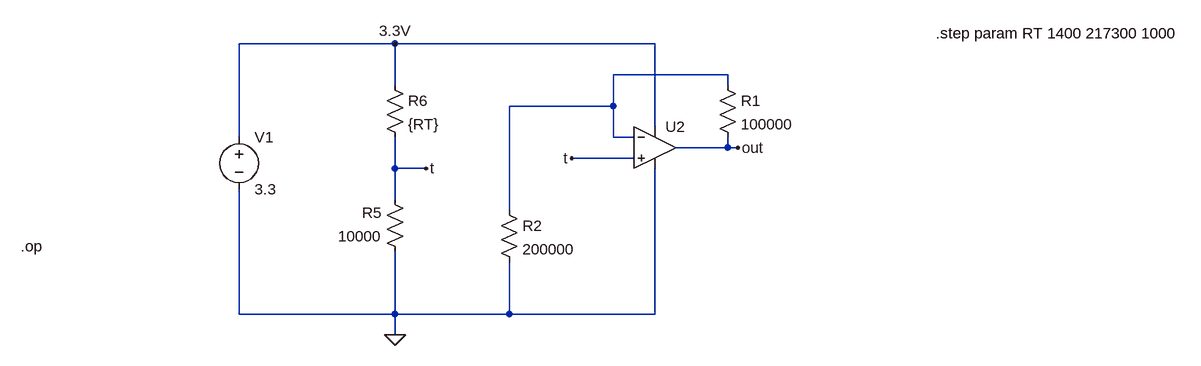
[diagram p0: schematic thermistor_sim.asc]
thermistor_sim.asc, the LTspice schematic file:
Version 4.1
SHEET 1 1836 680
WIRE 576 16 336 16
WIRE 976 16 576 16
WIRE 1088 64 912 64
WIRE 576 80 576 16
WIRE 1088 80 1088 64
WIRE 912 112 912 64
WIRE 912 112 752 112
WIRE 976 144 976 16
WIRE 336 160 336 16
WIRE 912 160 912 112
WIRE 944 160 912 160
WIRE 1088 176 1088 160
WIRE 1088 176 1008 176
WIRE 1104 176 1088 176
WIRE 944 192 848 192
WIRE 576 208 576 160
WIRE 624 208 576 208
WIRE 576 256 576 208
WIRE 752 272 752 112
WIRE 336 432 336 240
WIRE 576 432 576 336
WIRE 576 432 336 432
WIRE 752 432 752 352
WIRE 752 432 576 432
WIRE 976 432 976 208
WIRE 976 432 752 432
WIRE 576 464 576 432
FLAG 576 464 0
FLAG 576 16 3.3V
FLAG 624 208 t
FLAG 1104 176 out
FLAG 848 192 t
SYMBOL voltage 336 144 R0
SYMATTR InstName V1
SYMATTR Value 3.3
SYMBOL OpAmps\\UniversalOpAmp2 976 176 R0
SYMATTR InstName U2
SYMBOL res 592 352 R180
WINDOW 0 36 76 Left 2
WINDOW 3 36 40 Left 2
SYMATTR InstName R5
SYMATTR Value 10000
SYMBOL res 560 64 R0
SYMATTR InstName R6
SYMATTR Value {RT}
SYMBOL res 1072 64 R0
SYMATTR InstName R1
SYMATTR Value 100000
SYMBOL res 736 256 R0
SYMATTR InstName R2
SYMATTR Value 200000
TEXT 0 328 Left 2 !.op
TEXT 1408 0 Left 2 !.step param RT 1400 217300 1000

The netlist it stands for:
* thermistor_sim.asc
V1 3.3V 0 3.3
X§U2 t N001 3.3V 0 out level2 Avol=1Meg GBW=10Meg Slew=10Meg Ilimit=25m Rail=0 Vos=0 En=0 Enk=0 In=0 Ink=0 Rin=500Meg  ; pins In+ In- V+ V- OUT
R5 0 t 10000
R6 3.3V t {RT}
R1 N001 out 100000
R2 N001 0 200000
.op
.step param RT 1400 217300 1000
.lib UniversalOpAmp2.lib
.backanno
.end

* Results of the author's LTspice run, read from the files saved beside the schematic
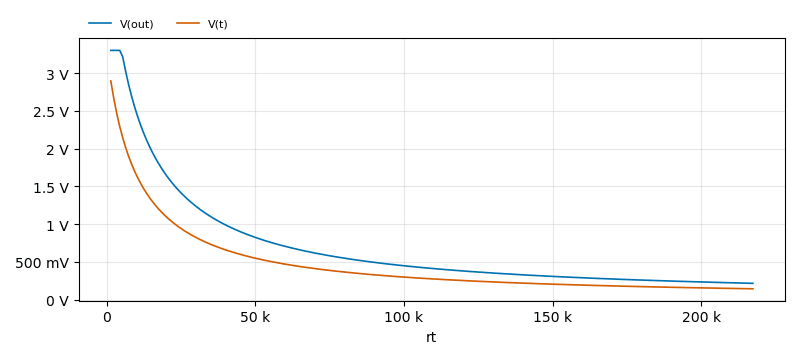
[diagram p1: Operating Point of thermistor_sim.asc, plotted from the saved traces]
* Operating Point, 1 run:
*   V(out): 3.3 V at rt=1.4 k, 217.5 mV at rt=217.3 k, min 217.5 mV, max 3.3 V
*   V(t): 2.895 V at rt=1.4 k, 145.2 mV at rt=217.3 k, min 145.2 mV, max 2.895 V
* From the log:
*   Semiconductor Device Operating Points:
*                           --- Diodes ---
*   Name:     u2:D1       u2:D2
*   Model:      x           x
*   Id:     -1.18e-16   -3.30e-12
*   Vd:     -1.17e-04   -3.30e+00
*   Req:     1.00e-12    1.00e-12
*   CAP:     0.00e+00    0.00e+00